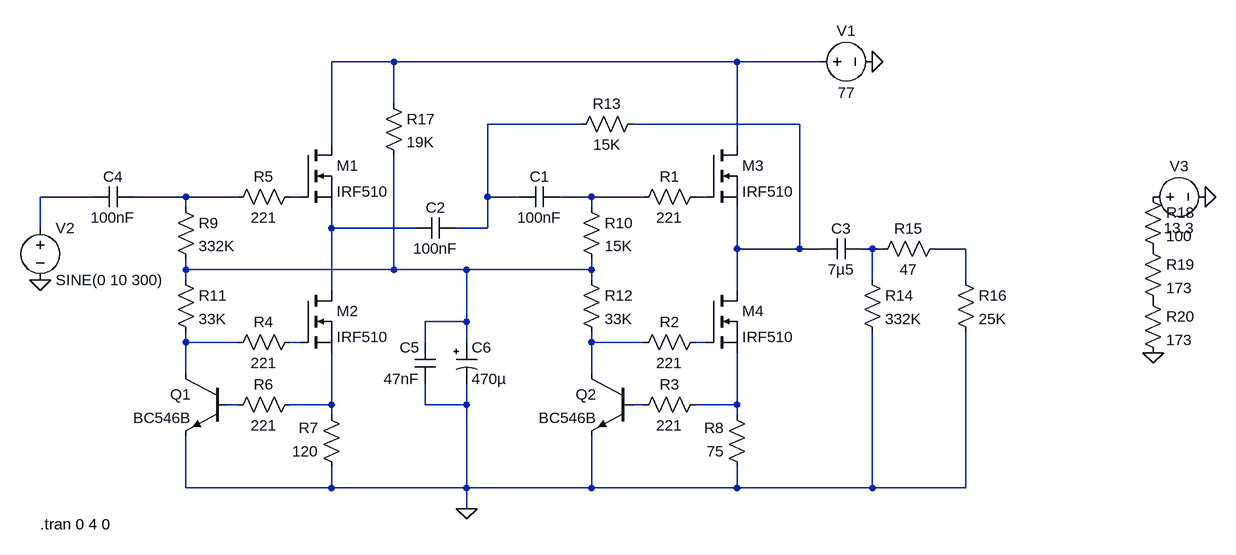
[diagram p0: schematic HPFV2.asc]
HPFV2.asc, the LTspice schematic file:
Version 4
SHEET 1 880 680
WIRE -400 -272 -496 -272
WIRE 128 -272 -400 -272
WIRE 256 -272 128 -272
WIRE -400 -208 -400 -272
WIRE -112 -176 -256 -176
WIRE 224 -176 -32 -176
WIRE -496 -144 -496 -272
WIRE 128 -144 128 -272
WIRE -864 -64 -944 -64
WIRE -720 -64 -800 -64
WIRE -640 -64 -720 -64
WIRE -544 -64 -560 -64
WIRE -256 -64 -256 -176
WIRE -208 -64 -256 -64
WIRE -96 -64 -144 -64
WIRE -16 -64 -96 -64
WIRE 80 -64 64 -64
WIRE -720 -48 -720 -64
WIRE -96 -48 -96 -64
WIRE -944 -16 -944 -64
WIRE -496 -16 -496 -48
WIRE -368 -16 -496 -16
WIRE -256 -16 -256 -64
WIRE -256 -16 -304 -16
WIRE 128 16 128 -48
WIRE 224 16 224 -176
WIRE 224 16 128 16
WIRE 256 16 224 16
WIRE 336 16 320 16
WIRE 352 16 336 16
WIRE 480 16 432 16
WIRE -720 48 -720 32
WIRE -400 48 -400 -128
WIRE -400 48 -720 48
WIRE -288 48 -400 48
WIRE -96 48 -96 32
WIRE -96 48 -288 48
WIRE -720 64 -720 48
WIRE -96 64 -96 48
WIRE 336 64 336 16
WIRE 480 64 480 16
WIRE -496 80 -496 -16
WIRE 128 80 128 16
WIRE -288 128 -288 48
WIRE -288 128 -352 128
WIRE -720 160 -720 144
WIRE -640 160 -720 160
WIRE -544 160 -560 160
WIRE -352 160 -352 128
WIRE -288 160 -288 128
WIRE -96 160 -96 144
WIRE -16 160 -96 160
WIRE 80 160 64 160
WIRE -720 208 -720 160
WIRE -96 208 -96 160
WIRE -640 256 -656 256
WIRE -496 256 -496 176
WIRE -496 256 -560 256
WIRE -352 256 -352 224
WIRE -288 256 -288 224
WIRE -288 256 -352 256
WIRE -16 256 -32 256
WIRE 128 256 128 176
WIRE 128 256 64 256
WIRE -496 272 -496 256
WIRE 128 272 128 256
WIRE -720 384 -720 304
WIRE -496 384 -496 352
WIRE -496 384 -720 384
WIRE -288 384 -288 256
WIRE -288 384 -496 384
WIRE -96 384 -96 304
WIRE -96 384 -288 384
WIRE 128 384 128 352
WIRE 128 384 -96 384
WIRE 336 384 336 144
WIRE 336 384 128 384
WIRE 480 384 480 144
WIRE 480 384 336 384
WIRE -288 416 -288 384
FLAG -288 416 0
FLAG 336 -272 0
FLAG -944 64 0
FLAG 768 176 0
FLAG 848 -64 0
SYMBOL nmos -544 -144 R0
SYMATTR InstName M1
SYMATTR Value IRF510
SYMBOL nmos -544 80 R0
SYMATTR InstName M2
SYMATTR Value IRF510
SYMBOL nmos 80 -144 R0
SYMATTR InstName M3
SYMATTR Value IRF510
SYMBOL nmos 80 80 R0
SYMATTR InstName M4
SYMATTR Value IRF510
SYMBOL res 80 -80 R90
WINDOW 0 0 56 VBottom 2
WINDOW 3 32 56 VTop 2
SYMATTR InstName R1
SYMATTR Value 221
SYMBOL res 80 144 R90
WINDOW 0 0 56 VBottom 2
WINDOW 3 32 56 VTop 2
SYMATTR InstName R2
SYMATTR Value 221
SYMBOL res 80 240 R90
WINDOW 0 0 56 VBottom 2
WINDOW 3 32 56 VTop 2
SYMATTR InstName R3
SYMATTR Value 221
SYMBOL res -544 144 R90
WINDOW 0 0 56 VBottom 2
WINDOW 3 32 56 VTop 2
SYMATTR InstName R4
SYMATTR Value 221
SYMBOL res -544 -80 R90
WINDOW 0 0 56 VBottom 2
WINDOW 3 32 56 VTop 2
SYMATTR InstName R5
SYMATTR Value 221
SYMBOL res -544 240 R90
WINDOW 0 0 56 VBottom 2
WINDOW 3 32 56 VTop 2
SYMATTR InstName R6
SYMATTR Value 221
SYMBOL res -480 368 R180
WINDOW 0 36 76 Left 2
WINDOW 3 36 40 Left 2
SYMATTR InstName R7
SYMATTR Value 120
SYMBOL res 144 368 R180
WINDOW 0 36 76 Left 2
WINDOW 3 36 40 Left 2
SYMATTR InstName R8
SYMATTR Value 75
SYMBOL npn -656 208 M0
SYMATTR InstName Q1
SYMATTR Value BC546B
SYMBOL npn -32 208 M0
SYMATTR InstName Q2
SYMATTR Value BC546B
SYMBOL res -736 -64 R0
SYMATTR InstName R9
SYMATTR Value 332K
SYMBOL res -112 -64 R0
SYMATTR InstName R10
SYMATTR Value 15K
SYMBOL res -736 48 R0
SYMATTR InstName R11
SYMATTR Value 33K
SYMBOL res -112 48 R0
SYMATTR InstName R12
SYMATTR Value 33K
SYMBOL cap -144 -80 R90
WINDOW 0 0 32 VBottom 2
WINDOW 3 32 32 VTop 2
SYMATTR InstName C1
SYMATTR Value 100nF
SYMBOL cap -304 -32 R90
WINDOW 0 0 32 VBottom 2
WINDOW 3 32 32 VTop 2
SYMATTR InstName C2
SYMATTR Value 100nF
SYMBOL res -16 -192 R90
WINDOW 0 0 56 VBottom 2
WINDOW 3 32 56 VTop 2
SYMATTR InstName R13
SYMATTR Value 15K
SYMBOL cap 320 0 R90
WINDOW 0 0 32 VBottom 2
WINDOW 3 32 32 VTop 2
SYMATTR InstName C3
SYMATTR Value 7µ5
SYMBOL res 320 48 R0
SYMATTR InstName R14
SYMATTR Value 332K
SYMBOL res 448 0 R90
WINDOW 0 0 56 VBottom 2
WINDOW 3 32 56 VTop 2
SYMATTR InstName R15
SYMATTR Value 47
SYMBOL cap -800 -80 R90
WINDOW 0 0 32 VBottom 2
WINDOW 3 32 32 VTop 2
SYMATTR InstName C4
SYMATTR Value 100nF
SYMBOL voltage 240 -272 R270
WINDOW 0 32 56 VTop 2
WINDOW 3 -32 56 VBottom 2
WINDOW 123 0 0 Left 2
WINDOW 39 0 0 Left 2
SYMATTR InstName V1
SYMATTR Value 77
SYMBOL polcap -304 160 R0
WINDOW 3 24 56 Left 2
SYMATTR Value 470µ
SYMATTR InstName C6
SYMATTR Description Capacitor
SYMATTR Type cap
SYMATTR SpiceLine V=63 Irms=0 Rser=1 Lser=0
SYMBOL res -416 -224 R0
SYMATTR InstName R17
SYMATTR Value 19K
SYMBOL res 464 48 R0
SYMATTR InstName R16
SYMATTR Value 25K
SYMBOL voltage -944 -32 R0
WINDOW 123 0 0 Left 2
WINDOW 39 0 0 Left 2
SYMATTR InstName V2
SYMATTR Value SINE(0 10 300)
SYMBOL cap -336 224 R180
WINDOW 0 24 56 Left 2
WINDOW 3 24 8 Left 2
SYMATTR InstName C5
SYMATTR Value 47nF
SYMBOL res 752 -80 R0
SYMATTR InstName R18
SYMATTR Value 100
SYMBOL res 752 0 R0
SYMATTR InstName R19
SYMATTR Value 173
SYMBOL res 752 80 R0
SYMATTR InstName R20
SYMATTR Value 173
SYMBOL voltage 752 -64 R270
WINDOW 0 32 56 VTop 2
WINDOW 3 -32 56 VBottom 2
WINDOW 123 0 0 Left 2
WINDOW 39 0 0 Left 2
SYMATTR InstName V3
SYMATTR Value 13.3
TEXT -944 440 Left 2 !.tran 0 4 0

The netlist it stands for:
* HPFV2.asc
M1 N001 N006 N009 N009 IRF510
M2 N009 N014 N018 N018 IRF510
M3 N001 N008 N003 N003 IRF510
M4 N003 N016 N020 N020 IRF510
R1 N008 N007 221
R2 N016 N015 221
R3 N020 N019 221
R4 N014 N013 221
R5 N006 N005 221
R6 N018 N017 221
R7 0 N018 120
R8 0 N020 75
Q1 N013 N017 0 0 BC546B
Q2 N015 N019 0 0 BC546B
R9 N005 N012 332K
R10 N007 N012 15K
R11 N012 N013 33K
R12 N012 N015 33K
C1 N007 N002 100nF
C2 N002 N009 100nF
R13 N003 N002 15K
C3 N010 N003 7µ5
R14 N010 0 332K
R15 N011 N010 47
C4 N005 N004 100nF
V1 N001 0 77
C6 N012 0 470µ V=63 Irms=0 Rser=1 Lser=0
R17 N001 N012 19K
R16 N011 0 25K
V2 N004 0 SINE(0 10 300)
C5 0 N012 47nF
R18 P001 P002 100
R19 P002 P003 173
R20 P003 0 173
V3 P001 0 13.3
.model NPN NPN
.model PNP PNP
.lib standard.bjt
.model NMOS NMOS
.model PMOS PMOS
.lib standard.mos
.tran 0 4 0
.backanno
.end